# EAGLE design Auction_Multi_RevA_Final (EAGLE 7.4.0)
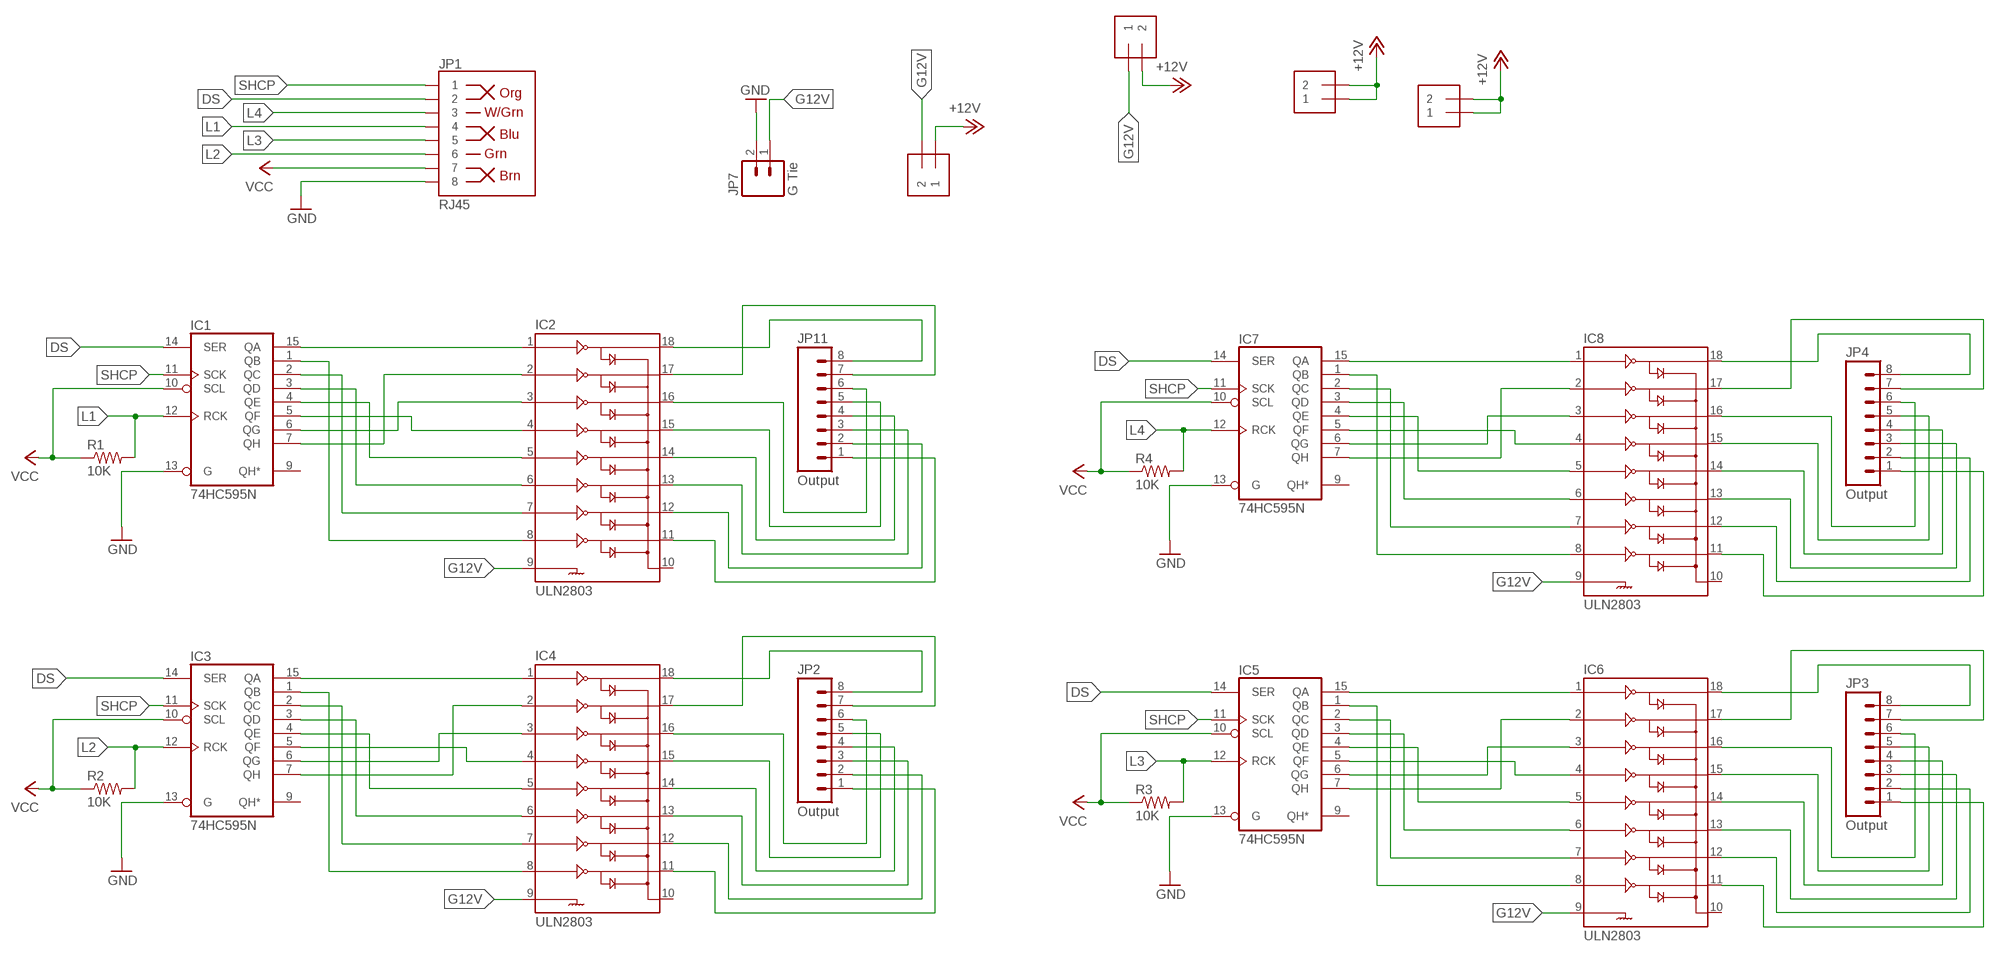
[diagram p0: schematic, sheet 1]

## Parts
IC1  74HC595N  [DIL16]
IC2  ULN2803  ULN2803DIP  [DIL18]
IC3  74HC595N  [DIL16]
IC4  ULN2803  ULN2803DIP  [DIL18]
IC5  74HC595N  [DIL16]
IC6  ULN2803  ULN2803DIP  [DIL18]
IC7  74HC595N  [DIL16]
IC8  ULN2803  ULN2803DIP  [DIL18]
JP1  RJ45  RJ45-8PTH  [RJ45-8]
JP2  Output  M083.5MM-8  [SCREWTERMINAL-3.5MM-8]
JP3  Output  M083.5MM-8  [SCREWTERMINAL-3.5MM-8]
JP4  Output  M083.5MM-8  [SCREWTERMINAL-3.5MM-8]
JP5  1X2-3.5MM  [1X2-3.5MM]
JP7  G Tie  M02PTH  [1X02]
JP8  1X2-3.5MM  [1X2-3.5MM]
JP9  1X2-3.5MM  [1X2-3.5MM]
JP10  1X2-3.5MM  [1X2-3.5MM]
JP11  Output  M083.5MM-8  [SCREWTERMINAL-3.5MM-8]
R1  10K  RESISTOREZ  [AXIAL-0.3EZ]
R2  10K  RESISTOREZ  [AXIAL-0.3EZ]
R3  10K  RESISTOREZ  [AXIAL-0.3EZ]
R4  10K  RESISTOREZ  [AXIAL-0.3EZ]

## Nets
+12V [High Current]: JP5.1 JP5.2 JP8.1 JP9.2 JP10.1 JP10.2
A: IC1.1(QB) IC2.8
A3: IC7.1(QB) IC8.8
AA [High Current]: IC2.11 JP11.1
AA1 [High Current]: IC4.11 JP2.1
AA2 [High Current]: IC6.11 JP3.1
AA3 [High Current]: IC8.11 JP4.1
B3: IC7.2(QC) IC8.7
BB [High Current]: IC2.12 JP11.2
BB1 [High Current]: IC4.12 JP2.2
BB2 [High Current]: IC6.12 JP3.2
BB3 [High Current]: IC8.12 JP4.2
C3: IC7.3(QD) IC8.6
CC [High Current]: IC2.13 JP11.3
CC1 [High Current]: IC4.13 JP2.3
CC2 [High Current]: IC6.13 JP3.3
CC3 [High Current]: IC8.13 JP4.3
D3: IC7.4(QE) IC8.5
DD [High Current]: IC2.14 JP11.4
DD1 [High Current]: IC4.14 JP2.4
DD2 [High Current]: IC6.14 JP3.4
DD3 [High Current]: IC8.14 JP4.4
DP: IC1.15(QA) IC2.1
DP1: IC3.15(QA) IC4.1
DP2: IC5.15(QA) IC6.1
DP3: IC7.15(QA) IC8.1
DPA [High Current]: IC2.18 JP11.8
DPA1 [High Current]: IC4.18 JP2.8
DPA2 [High Current]: IC6.18 JP3.8
DPA3 [High Current]: IC8.18 JP4.8
DS: IC1.14(SER) IC3.14(SER) IC5.14(SER) IC7.14(SER) JP1.2
E1: IC3.5(QF) IC4.4
E2: IC5.5(QF) IC6.4
E3: IC7.5(QF) IC8.4
EE [High Current]: IC2.15 JP11.5
EE1 [High Current]: IC4.15 JP2.5
EE2 [High Current]: IC6.15 JP3.5
EE3 [High Current]: IC8.15 JP4.5
F: IC1.6(QG) IC2.3
F1: IC3.6(QG) IC4.3
F2: IC5.6(QG) IC6.3
F3: IC7.6(QG) IC8.3
FF [High Current]: IC2.16 JP11.6
FF1 [High Current]: IC4.16 JP2.6
FF2 [High Current]: IC6.16 JP3.6
FF3 [High Current]: IC8.16 JP4.6
G: IC1.7(QH) IC2.2
G1: IC3.7(QH) IC4.2
G2: IC5.7(QH) IC6.2
G3: IC7.7(QH) IC8.2
G12V [High Current]: IC2.9 IC4.9 IC6.9 IC8.9 JP7.1 JP8.2 JP9.1
GG [High Current]: IC2.17 JP11.7
GG1 [High Current]: IC4.17 JP2.7
GG2 [High Current]: IC6.17 JP3.7
GG3 [High Current]: IC8.17 JP4.7
GND [Power]: IC1.13(G) IC3.13(G) IC5.13(G) IC7.13(G) JP1.8 JP7.2
L1: IC1.12(RCK) JP1.4 R1.P$2
L2: IC3.12(RCK) JP1.6 R2.P$2
L3: IC5.12(RCK) JP1.5 R3.P$2
L4: IC7.12(RCK) JP1.3 R4.P$2
N$1: IC3.4(QE) IC4.5
N$2: IC1.2(QC) IC2.7
N$3: IC1.4(QE) IC2.5
N$4: IC1.3(QD) IC2.6
N$5: IC1.5(QF) IC2.4
N$6: IC3.3(QD) IC4.6
N$7: IC3.2(QC) IC4.7
N$8: IC3.1(QB) IC4.8
N$9: IC5.1(QB) IC6.8
N$10: IC5.2(QC) IC6.7
N$11: IC5.3(QD) IC6.6
N$12: IC5.4(QE) IC6.5
SHCP: IC1.11(SCK) IC3.11(SCK) IC5.11(SCK) IC7.11(SCK) JP1.1
VCC [Power]: IC1.10(SCL) IC3.10(SCL) IC5.10(SCL) IC7.10(SCL) JP1.7 R1.P$1 R2.P$1 R3.P$1 R4.P$1
Unconnected: IC1.9(QH*) IC2.10 IC3.9(QH*) IC4.10 IC5.9(QH*) IC6.10 IC7.9(QH*) IC8.10

## Power pins joined to a net without a drawn wire
GND: IC1.8(GND) IC3.8(GND) IC5.8(GND) IC7.8(GND)
VCC: IC1.16(VCC) IC3.16(VCC) IC5.16(VCC) IC7.16(VCC)

## Library data of the parts
IC1 IC3 IC5 IC7 = 74xx-eu:74*595: 8-bit SHIFT REGISTER, output latch; MF: TEXAS INSTRUMENTS; MPN: SN74HC595N; OC_NEWARK: 60K6845
IC2 IC4 IC6 IC8 = SparkFun-PowerIC:ULN2803: Darlington Driver ULN2803 Darlington array. 500mA max per channel, 8-channel package. Spark Fun Electronics SKU : COM-00312; MF: Arrow Electronics; MPN: ULN2803A; OC_NEWARK: 89K1143
JP1 = SparkFun-Connectors:RJ45-8: RJ45 Jack Simple RJ45, 8-pin connection - connector for common Cat5, Cat5e, and Cat6 Ethernet cables. Footprint not yet proven in production. Connector sku is PRT-00643; Breakout PCB sku is BOB-00716.; MPN: 54602-908LF; OC_NEWARK: 51M7962; PROD_ID: CONN-08506
JP2-JP4 JP11 = SparkFun-Connectors:M08: Header 8 Standard 8-pin 0.1" header. Use with straight break away headers (SKU : PRT-00116), right angle break away headers (PRT-00553), swiss pins (PRT-00743), machine pins (PRT-00117), and female headers (PRT-00115).; MPN: 20020327-C081B01LF; OC_NEWARK: 59R8949
JP5 JP8-JP10 = adafruit:1X2: 3.5mm Terminal block http://www.ladyada.net/library/pcb/eaglelibrary.html; MPN: 1776275-2; OC_NEWARK: 97M9695
JP7 = SparkFun-Connectors:M02: Standard 2-pin 0.1" header. Use with - straight break away headers ( PRT-00116) - right angle break away headers (PRT-00553) - swiss pins (PRT-00743) - machine pins (PRT-00117) - female headers (PRT-00115) Molex polarized connector foot print use with: PRT-08233 with associated crimp pins and housings. 2.54_SCREWTERM for use with PRT-10571. 3.5mm Screw Terminal footprints for PRT-08084 5mm Screw Terminal footprints for use with PRT-08432; MPN: 2211S-02G; OC_NEWARK: 08N6744
R1-R4 = SparkFun-Passives:RESISTOR: Resistor Basic schematic elements and footprints for 0603, 1206, and PTH resistors.; MF: FARNELL; MPN: MCF 0.25W 10K; OC_NEWARK: 38K0328

## Net classes
0 Signal: width 0.305 mm, drill 0.508 mm, clearance 0.305 mm
1 Power: width 0.508 mm, drill 0.508 mm, clearance 0.508 mm
2 High Current: width 1.016 mm, drill 1.016 mm, clearance 1.016 mm

## Board
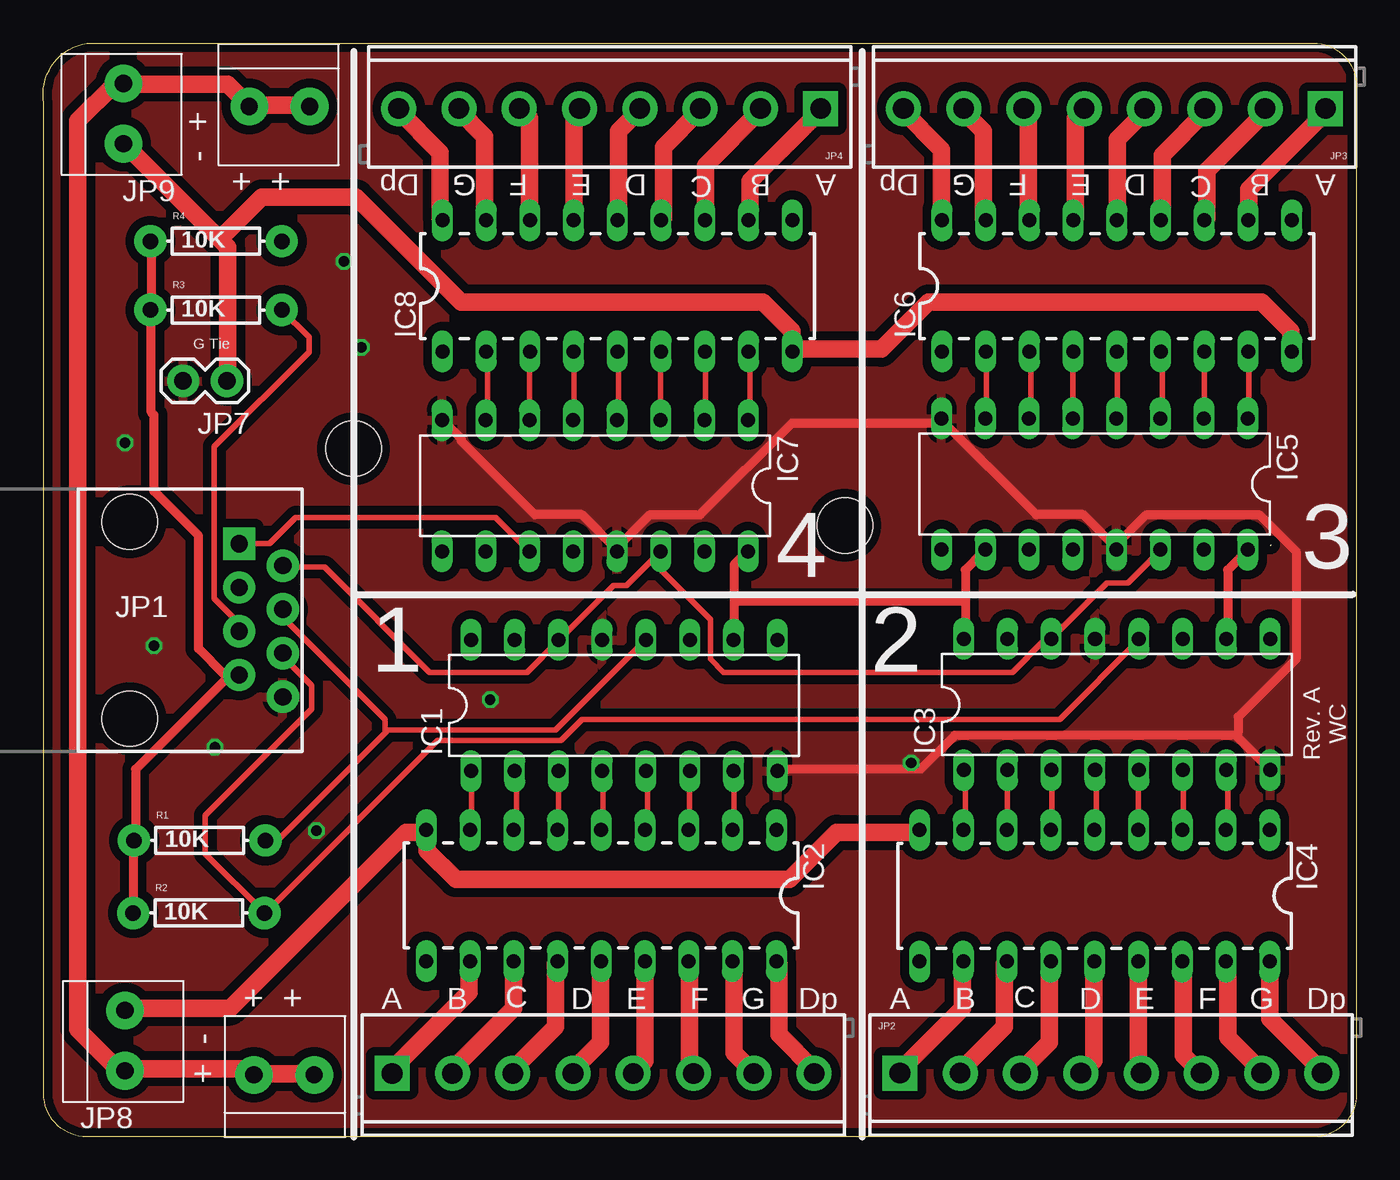
[diagram p1: board, top side]
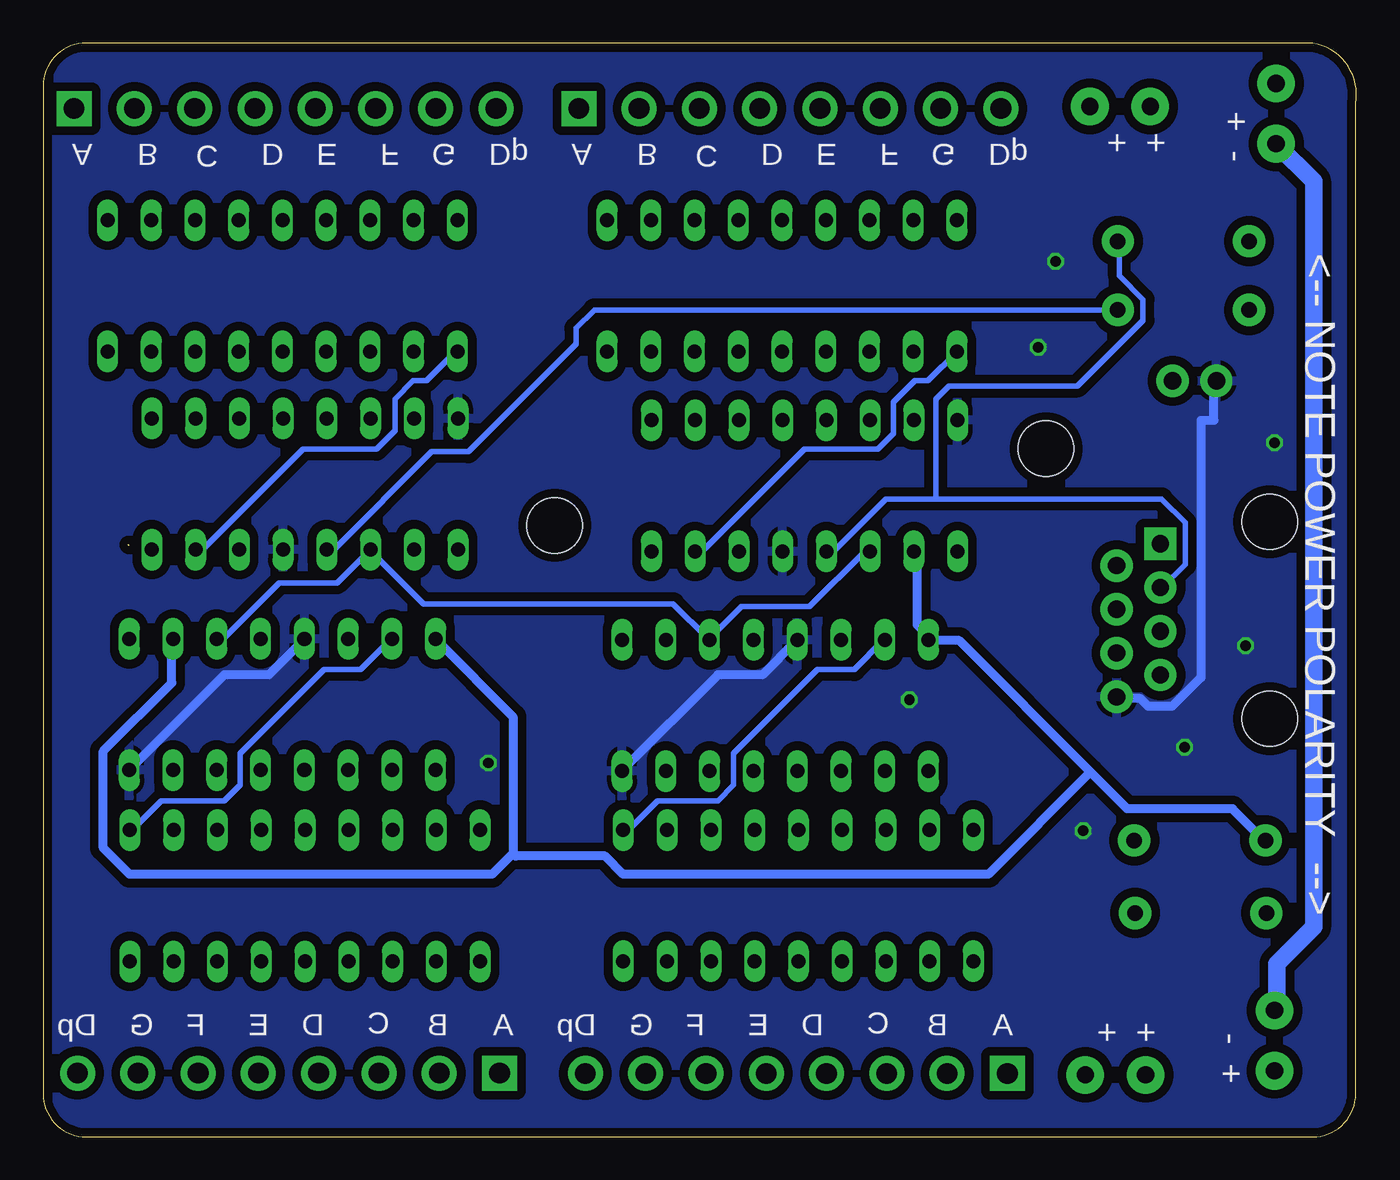
[diagram p2: board, bottom side, seen from below]

Size 76.24 x 63.5 mm. Coordinates in mm from the lower left corner, seen from the top.
Outline: 71.24,34.34 arc90 71.3,34.38
Outline: 73.74,0 2.54,0 arc-90 0.04,2.5 0.04,60 arc-90 2.54,63.5 73.74,63.5 arc-90 76.24,61 76.24,2.5 arc-90 73.74,0
Copper layers (1*16): Top 0.0356mm / dielectric 1.5011mm / Bottom 0.0356mm
Design rules "LaenPCBOrder": minimum track width 6mil, minimum drill 13mil, track to track 6mil, track to pad 6mil, pad to pad 6mil, via to via 6mil, smd to smd 6mil, copper to edge 15mil, drill to drill 6mil, minimum pad ring 7mil, minimum via ring 7mil, stop-mask expansion 3mil, vias tented up to drill 0mil, thermal gap 10mil
Holes 3.2 mm at 46.54,35.5 18.02,39.95

### Footprints (pad centres in the part's own frame; a part is rotated, then mirrored left to right if it is on the bottom)
DIL16 = drill 0.813 long: 1 -8.89,-3.81; 2 -6.35,-3.81; 3 -3.81,-3.81; 4 -1.27,-3.81; 5 1.27,-3.81; 6 3.81,-3.81; 7 6.35,-3.81; 8 8.89,-3.81; 9 8.89,3.81; 10 6.35,3.81; 11 3.81,3.81; 12 1.27,3.81; 13 -1.27,3.81; 14 -3.81,3.81; 15 -6.35,3.81; 16 -8.89,3.81
DIL18 = drill 0.813 long: 1 -10.16,-3.81; 2 -7.62,-3.81; 3 -5.08,-3.81; 4 -2.54,-3.81; 5 0,-3.81; 6 2.54,-3.81; 7 5.08,-3.81; 8 7.62,-3.81; 9 10.16,-3.81; 10 10.16,3.81; 11 7.62,3.81; 12 5.08,3.81; 13 2.54,3.81; 14 0,3.81; 15 -2.54,3.81; 16 -5.08,3.81; 17 -7.62,3.81; 18 -10.16,3.81
RJ45-8 = drill 1 pad 1.88 square: 1 -4.445,6.35 | drill 1 pad 1.88: 2 -3.175,8.89; 3 -1.905,6.35; 4 -0.635,8.89; 5 0.635,6.35; 6 1.905,8.89; 7 3.175,6.35; 8 4.445,8.89 | hole 3.2: -5.715,0; 5.715,0
SCREWTERMINAL-3.5MM-8 = drill 1.2 pad 2.032 square: 1 0,0 | drill 1.2 pad 2.032: 2 3.5,0; 3 7,0; 4 10.5,0; 5 14,0; 6 17.5,0; 7 21,0; 8 24.5,0
1X2-3.5MM = drill 1 pad 2.184: 1 1.8,0; 2 -1.7,0
1X02 = drill 1.016 pad 1.88: 1 0,0; 2 2.54,0
AXIAL-0.3EZ = drill 0.9 pad 1.88: P$1 -3.81,0; P$2 3.81,0

### Placement (x,y rotation side)
IC1  33.73,25.05 0 top
IC2  32.4,14.01 180 top
IC3  62.34,25.1 0 top
IC4  61.04,14 180 top
IC5  61.04,37.9 180 top
IC6  62.34,49.4 0 top
IC7  32.04,37.8 180 top
IC8  33.34,49.4 0 top
JP1  5.03,29.99 270 top
JP2  49.74,3.7 0 top
JP3  74.44,59.7 180 top
JP4  45.14,59.7 180 top
JP5  13.94,3.6 0 top
JP7  10.67,43.89 180 top
JP8  4.75,5.64 270 top
JP9  4.66,59.46 270 top
JP10  13.77,59.82 180 top
JP11  20.26,3.68 0 top
R1  9.09,17.21 0 top
R2  9.04,13 0 top
R3  10.04,48 0 top
R4  10.04,52 0 top

### Tracks (layer width: path | path; a pad name or v marks a point on that pad's centre or on a via)
+12V
  Top 1.016: JP5.1 15.74,3.66 12.38,3.66 JP5.2 11.93,3.96 4.76,3.96 | 4.76,3.96 JP8.1 | JP10.2 15.43,59.89 12.38,59.89 JP10.1 11.93,59.89 10.71,61.11 4.76,61.11 JP9.2 4.16,61.11 2.02,58.98 2.02,6.25 4.31,3.96 4.76,3.96
A
  Top 0.305: IC2.8 24.88,17.83 24.88,21.18 IC1.1
A3
  Top 0.305: IC7.1 41.04,41.76 41.04,45.57 IC8.8
AA
  Top 1.016: IC2.11 24.73,10.06 24.73,8.38 20.16,3.81 JP11.1
AA1
  Top 1.016: IC4.11 53.38,10.06 53.38,7.47 49.72,3.81 JP2.1
AA2
  Top 1.016: IC6.11 69.99,53.34 69.99,55.02 74.56,59.59 JP3.1
AA3
  Top 1.016: IC8.11 41.04,53.34 41.04,55.47 45.15,59.59 JP4.1
B3
  Top 0.305: IC7.2 38.45,41.76 38.45,45.57 IC8.7
BB
  Top 1.016: IC2.12 27.32,10.06 27.32,7.47 23.66,3.81 JP11.2
BB1
  Top 1.016: IC4.12 55.82,10.06 55.82,6.4 53.23,3.81 JP2.2
BB2
  Top 1.016: IC6.12 67.55,53.34 67.55,56.08 71.06,59.59 JP3.2
BB3
  Top 1.016: IC8.12 38.45,53.34 38.45,56.39 41.65,59.59 JP4.2
C3
  Top 0.305: IC7.3 35.85,41.76 35.85,45.57 IC8.6
CC
  Top 1.016: IC2.13 29.76,10.06 29.76,6.4 27.17,3.81 JP11.3
CC1
  Top 1.016: IC4.13 58.41,10.06 58.41,5.49 56.73,3.81 JP2.3
CC2
  Top 1.016: IC6.13 64.96,53.34 64.96,57 67.55,59.59 JP3.3
CC3
  Top 1.016: IC8.13 36.01,53.34 36.01,57.45 38.14,59.59 JP4.3
D3
  Top 0.305: IC7.4 33.42,41.76 33.42,45.57 IC8.5
DD
  Top 1.016: IC2.14 32.35,10.06 32.35,5.49 30.67,3.81 JP11.4
DD1
  Top 1.016: IC4.14 61,10.06 61,4.42 60.39,3.81 JP2.4
DD2
  Top 1.016: IC6.14 62.37,53.34 62.37,57.91 64.05,59.59 JP3.4
DD3
  Top 1.016: IC8.14 33.42,53.34 33.42,58.37 34.64,59.59 JP4.4
DP
  Bottom 0.305: IC2.1 42.26,17.83 40.58,19.51 37.07,19.51 36.16,20.42 36.16,22.25 31.28,27.13 29.15,27.13 27.47,28.8 IC1.15
DP1
  Bottom 0.305: IC4.1 71.06,17.83 69.38,19.51 65.72,19.51 64.81,20.42 64.81,22.25 59.93,27.13 57.8,27.13 56.12,28.8 IC3.15
DP2
  Bottom 0.305: IC5.15 67.25,34.14 66.94,34.14 61.15,39.93 56.89,39.93 55.82,41 55.82,42.82 54.75,43.89 53.99,43.89 52.31,45.57 IC6.1
DP3
  Bottom 0.305: IC7.15 38.29,34.14 37.84,34.14 32.04,39.93 27.78,39.93 26.86,40.84 26.86,42.67 25.64,43.89 24.88,43.89 23.21,45.57 IC8.1
DPA
  Top 1.016: IC2.18 42.71,10.06 42.71,5.94 44.85,3.81 JP11.8
DPA1
  Top 1.016: IC4.18 71.21,10.06 71.21,6.86 74.26,3.81 JP2.8
DPA2
  Top 1.016: IC6.18 52.16,53.34 52.16,57.3 49.88,59.59 JP3.8
DPA3
  Top 1.016: IC8.18 23.05,53.34 23.05,57.15 20.61,59.59 JP4.8
DS
  Top 0.305: IC5.14 64.81,33.98 62.98,32.16 61.76,32.16 58.56,28.96 IC3.14 58.41,28.8 58.1,28.8 56.28,26.98 39.51,26.98 38.75,27.74 38.75,30.02 35.4,33.38 IC7.14 33.87,32 33.11,32 30.06,28.96 IC1.14 29.91,28.8 28.08,26.98 22.44,26.98 16.35,33.07 14.06,33.07 JP1.2
E1
  Top 0.305: IC4.4 63.59,17.83 63.59,21.18 IC3.5
E2
  Top 0.305: IC5.5 59.78,41.76 59.78,45.57 IC6.4
E3
  Top 0.305: IC7.5 30.83,41.76 30.83,45.57 IC8.4
EE
  Top 1.016: IC2.15 34.94,10.06 34.94,4.42 34.33,3.81 JP11.5
EE1
  Top 1.016: IC4.15 63.59,10.06 63.59,3.81 JP2.5
EE2
  Top 1.016: IC6.15 59.93,53.34 59.93,59.13 60.39,59.59 JP3.5
EE3
  Top 1.016: IC8.15 30.83,53.34 30.83,59.28 31.13,59.59 JP4.5
F
  Top 0.305: IC2.3 37.53,17.83 37.53,21.18 IC1.6
F1
  Top 0.305: IC4.3 66.18,17.83 66.18,21.18 IC3.6
F2
  Top 0.305: IC5.6 57.34,41.76 57.34,45.57 IC6.3
F3
  Top 0.305: IC7.6 28.23,41.76 28.23,45.57 IC8.3
FF
  Top 1.016: IC2.16 37.53,10.06 37.53,3.96 37.68,3.81 JP11.6
FF1
  Top 1.016: IC4.16 66.18,10.06 66.18,4.72 67.1,3.81 JP2.6
FF2
  Top 1.016: IC6.16 57.19,53.34 57.19,59.44 57.04,59.59 JP3.6
FF3
  Top 1.016: IC8.16 28.23,53.34 28.23,59.13 27.78,59.59 JP4.6
G
  Top 0.305: IC2.2 40.12,17.83 40.12,21.18 IC1.7
G1
  Top 0.305: IC4.2 68.77,17.83 68.77,21.18 IC3.7
G2
  Top 0.305: IC5.7 54.75,41.76 54.75,45.57 IC6.2
G3
  Top 0.305: IC7.7 25.8,41.76 25.8,45.57 IC8.2
G12V
  Top 1.016: JP8.2 4.76,7.47 10.86,7.47 21.07,17.68 22.14,17.68 IC2.9 22.29,17.22 22.29,16.61 23.97,14.94 43.32,14.94 46.07,17.68 50.79,17.68 IC4.9 | 10.25,52.12 4.76,57.61 JP9.1 | 10.25,52.12 10.71,51.66 10.71,43.89 JP7.1 | IC6.9 72.43,45.72 72.43,46.79 70.75,48.46 51.4,48.46 48.66,45.72 43.63,45.72 IC8.9 43.47,46.18 43.47,46.79 41.8,48.46 24.27,48.46 18.18,54.56 12.69,54.56 10.25,52.12
  Bottom 1.016: JP8.2 4.61,7.47 4.61,10.06 2.48,12.19 2.48,55.47 4.61,57.61 JP9.1
GG
  Top 1.016: IC2.17 40.12,10.06 40.12,4.88 41.19,3.81 JP11.7
GG1
  Top 1.016: IC4.17 68.77,10.06 68.77,5.79 70.75,3.81 JP2.7
GG2
  Top 1.016: IC6.17 54.6,53.34 54.6,58.37 53.38,59.59 JP3.7
GG3
  Top 1.016: IC8.17 25.64,53.34 25.64,58.06 24.12,59.59 JP4.7
GND  (via drill 0.6)
  Top 0.508: 69.23,23.32 52.92,23.32 50.94,21.34 42.71,21.34 IC1.8 | 69.23,23.32 71.21,21.34 IC3.8 | IC7.8 23.21,41.6 24.27,40.54 24.27,40.39 28.54,36.12 31.28,36.12 33.26,34.14 IC7.13 33.42,34.29 35.24,36.12 38.14,36.12 43.47,41.45 52.01,41.45 IC5.8 52.16,41.6 57.65,36.12 60.39,36.12 62.37,34.14 IC5.13 62.37,34.44 64.05,36.12 70.6,36.12 72.74,33.98 72.74,27.74 69.38,24.38 69.38,23.47 69.23,23.32
  Bottom 0.508: IC1.8 42.56,21.34 37.07,26.82 34.48,26.82 32.5,28.8 IC1.13 | IC3.8 71.21,21.34 65.72,26.82 63.13,26.82 61.15,28.8 IC3.13 | JP7.2 8.27,43.74 8.27,41.6 9.03,41.6 9.03,26.67 10.71,24.99 12.08,24.99 12.54,25.45 13.91,25.45 JP1.8 | 23.05,41.6 IC7.8
  other vias: 6.44,28.51 4.75,40.3 9.97,22.62 15.86,17.77 25.95,25.38 50.39,21.71 18.47,45.83 17.47,50.83
  pour Top (isolate 0.508): -9.96,75 85.04,75 85.04,-10 -9.96,-10
  pour Bottom (isolate 0.508): -4.96,70 80.04,70 80.04,-5 -4.96,-5
L1
  Top 0.305: 19.93,23.55 13.6,17.22 12.99,17.22 R1.P$2 | 19.93,23.55 20,23.62 29.76,23.62 34.94,28.8 IC1.12 | JP1.4 14.06,30.48 14.06,30.02 19.85,24.23 19.85,23.62 19.93,23.55
L2
  Top 0.305: IC3.12 63.59,28.8 59.02,24.23 31.28,24.23 30.06,23.01 22.9,23.01 12.99,13.11 R2.P$2 9.41,16.44 9.41,18.67 15.59,24.84 15.59,26.21 14.06,27.74 14.06,28.04 JP1.6
L3
  Top 0.305: JP1.5 11.32,29.41 11.32,29.87 9.95,31.24 9.95,40.08 15.43,45.57 15.43,46.42 R3.P$2
  Bottom 0.305: IC5.12 59.63,34.14 59.32,34.14 53.69,39.78 51.55,39.78 45.3,46.02 45.3,46.94 44.24,48.01 13.91,48.01 R3.P$2
L4
  Bottom 0.305: 24.42,37.03 11.32,37.03 9.95,35.66 9.95,33.22 11.32,31.85 JP1.3 | 24.42,37.03 27.32,37.03 30.22,34.14 30.67,34.14 IC7.12 | 24.42,37.03 24.42,42.82 23.66,43.59 16.19,43.59 12.38,47.4 12.38,48.62 13.76,49.99 13.76,51.97 R4.P$2
N$1
  Top 0.305: IC4.5 61.15,17.83 61.15,21.18 IC3.4
N$2
  Top 0.305: IC2.7 27.47,17.83 27.47,21.18 IC1.2
N$3
  Top 0.305: IC2.5 32.5,17.83 32.5,21.18 IC1.4
N$4
  Top 0.305: IC2.6 29.91,17.83 29.91,21.18 IC1.3
N$5
  Top 0.305: IC2.4 35.09,17.83 35.09,21.18 IC1.5
N$6
  Top 0.305: IC4.6 58.56,17.83 58.56,21.18 IC3.3
N$7
  Top 0.305: IC4.7 55.97,17.83 55.97,21.18 IC3.2
N$8
  Top 0.305: IC4.8 53.53,17.83 53.53,21.18 IC3.1
N$9
  Top 0.305: IC5.1 69.99,41.76 69.99,45.57 IC6.8
N$10
  Top 0.305: IC5.2 67.4,41.76 67.4,45.57 IC6.7
N$11
  Top 0.305: IC5.3 64.96,41.76 64.96,45.57 IC6.6
N$12
  Top 0.305: IC5.4 62.37,41.76 62.37,45.57 IC6.5
SHCP
  Top 0.305: JP1.1 11.47,34.44 13.15,34.44 14.67,35.97 26.25,35.97 28.08,34.14 IC7.11
  Bottom 0.305: IC3.11 66.03,28.96 65.72,28.96 62.52,32.16 59.17,32.16 57.34,33.98 IC5.11 57.19,33.98 54.14,30.94 39.66,30.94 37.68,28.96 IC1.11 37.53,28.96 35.7,30.79 31.74,30.79 28.54,33.98 IC7.11
VCC
  Top 0.508: IC3.10 68.77,28.96 68.77,32.92 69.84,33.98 IC5.16 | 40.12,31.09 40.12,33.22 40.88,33.98 IC7.16 | 40.12,31.09 40.12,28.96 IC1.10 | 53.53,31.09 53.53,32.92 54.6,33.98 IC5.10 | 53.53,31.09 53.53,28.96 IC3.16 | 53.53,31.09 40.12,31.09 | R2.P$1 5.22,13.11 5.22,17.07 R1.P$1 5.37,17.37 5.37,21.34 10.71,26.67 11.32,26.67 JP1.7 10.56,26.82 9.03,28.35 9.03,34.9 6.44,37.49 6.44,41.91 6.29,42.06 6.29,47.85 R3.P$1 6.29,48.01 6.29,51.97 R4.P$1
  Bottom 0.508: 48.96,16.46 50.18,15.24 71.21,15.24 72.74,16.76 72.74,22.4 68.77,26.36 68.77,28.8 IC3.10 | 48.96,16.46 48.96,24.38 53.38,28.8 IC3.16 | 15.43,21.18 13.3,19.05 7.2,19.05 5.37,17.22 R1.P$1 | 15.43,21.18 23.05,28.8 24.73,28.8 IC1.16 24.88,29.11 25.49,29.72 25.49,33.83 IC7.10 | 15.43,21.18 21.38,15.24 42.56,15.24 43.63,16.31 48.81,16.31 48.96,16.46

### Text on the board
tNames: - + | Dp | G | F | E | D | C | B | A | Dp | G | F | E | D | C | B | A | + + | 3 | 4 | 1 | 2 | Rev. A / WC | C | C | + + | A | B | D | E | F | G | Dp | A | B | D | E | F | G | Dp | + -
bNames: Dp | G | F | E | D | C | B | A | Dp | G | F | E | D | C | B | A | - + | + + | <-- NOTE POWER POLARITY --> | A | B | C | D | E | F | G | Dp | A | B | C | D | E | F | G | Dp | + + | + -